# EAGLE schematic SolarRS485-V1.1 (EAGLE 7.4.0)
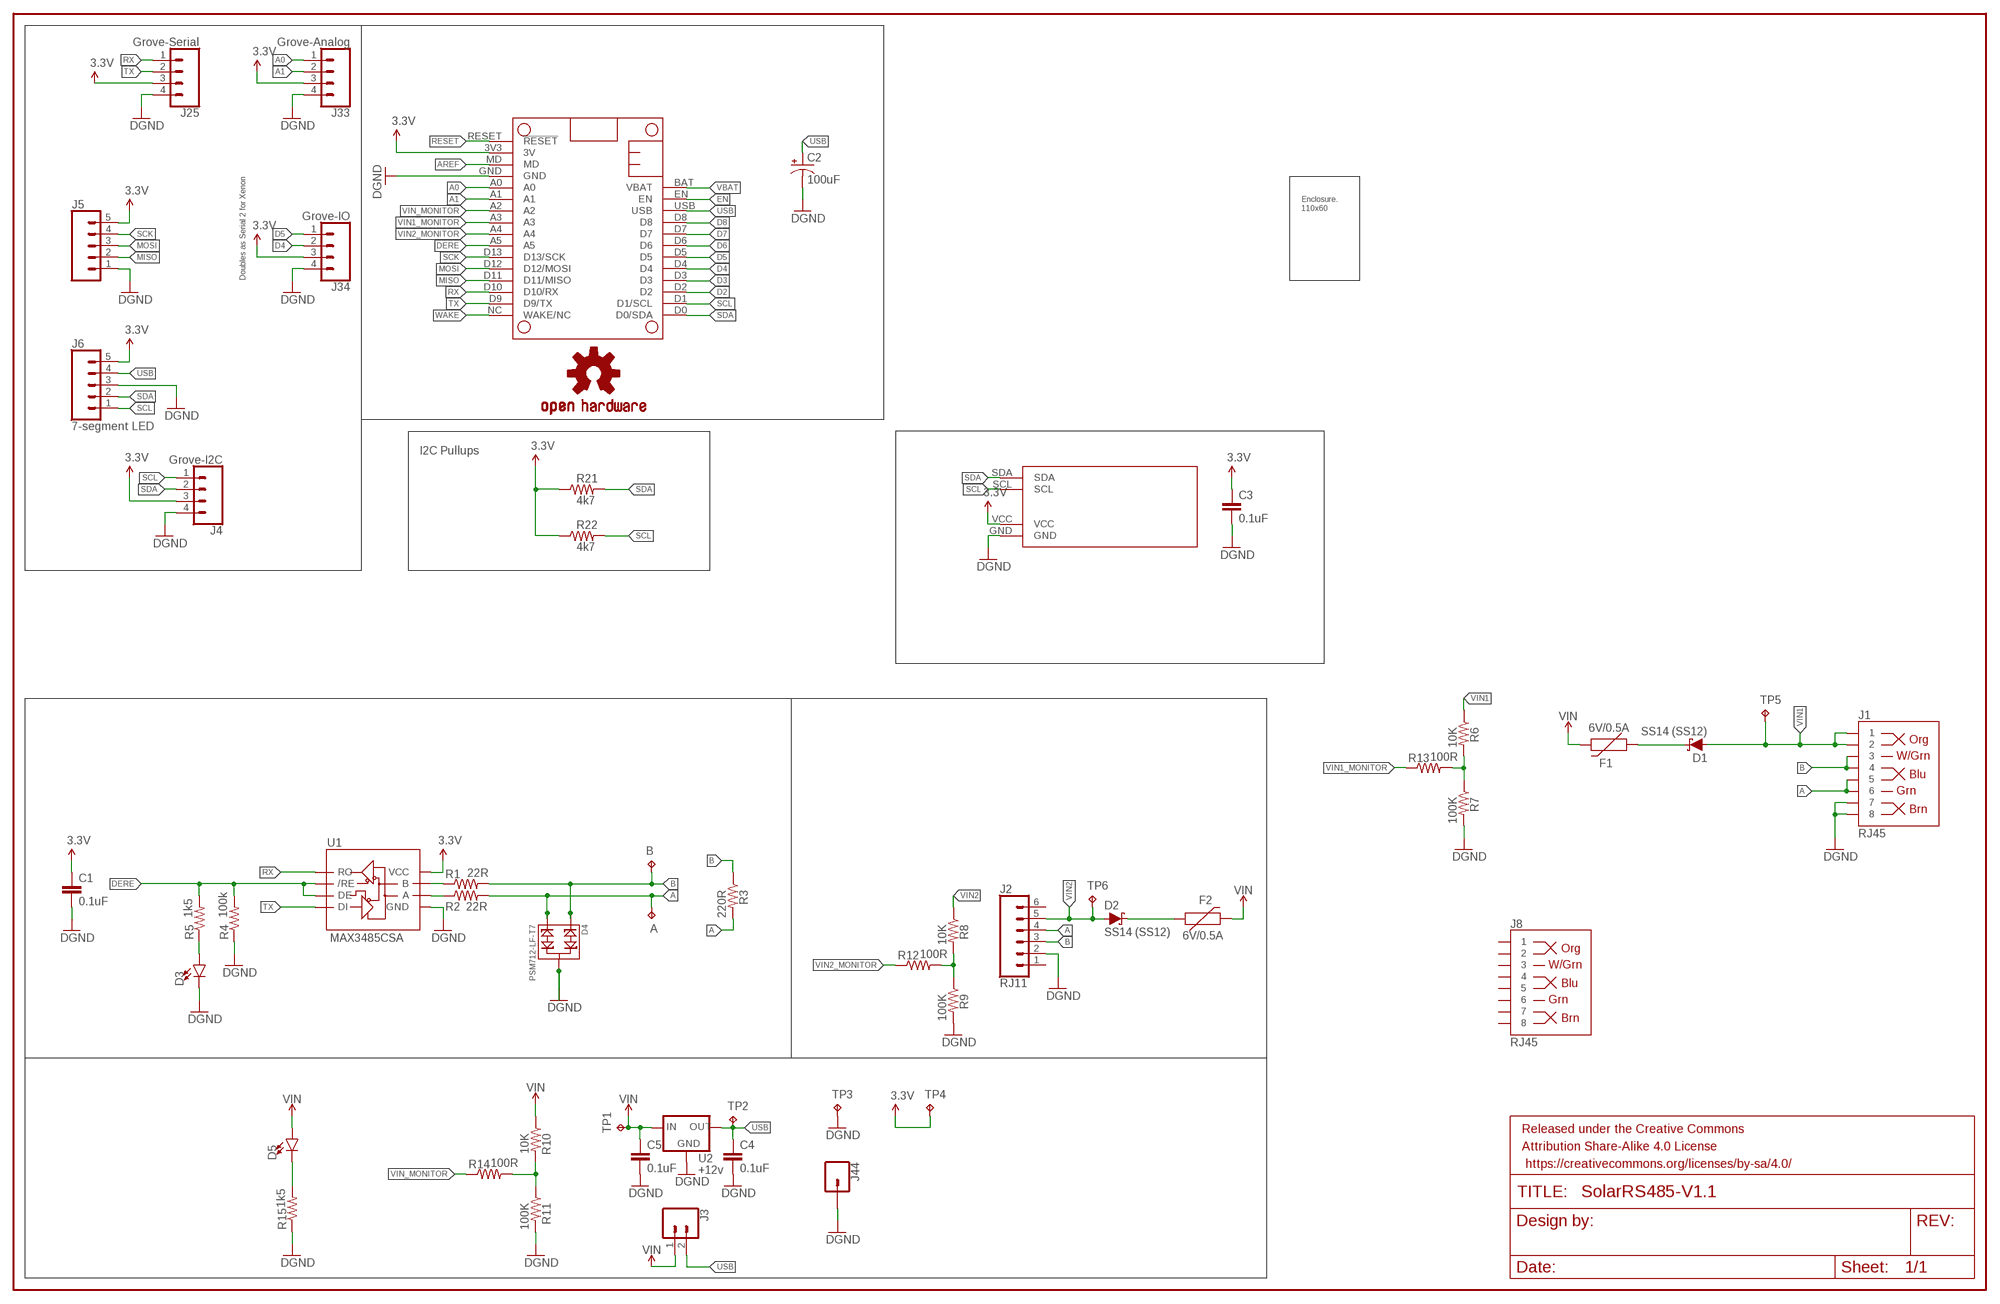
[diagram p0: schematic, sheet 1]

## Parts
A  TPTP15R  [TP15R]
B  TPTP15R  [TP15R]
C1  0.1uF  0.1UF-0805-25V  [0805]
C2  100uF  100UF-POLAR-RADIAL-2.5MM-25V-20%  [CPOL-RADIAL-2.5MM-6.5MM]
C3  0.1uF  0.1UF-0805-25V  [0805]
C4  0.1uF  0.1UF-0805-25V  [0805]
C5  0.1uF  0.1UF-0805-25V  [0805]
D1  SS14 (SS12)  DIODE-SCHOTTKY-SS14  [SMA-DIODE]
D2  SS14 (SS12)  DIODE-SCHOTTKY-SS14  [SMA-DIODE]
D3  LEDLED-1206-BOTTOM-2.0MM-BLUE  [LED-1206-BOTTOM-2.0MM]
D4  PSM712-LF-T7  SMD-DIODE-TVS-5V-225MW(SOT-23)  [SOT-23]
D5  LED1206  [LED-1206]
F1  6V/0.5A  PPTC_HALF-AMP  [1206]
F2  6V/0.5A  PPTC_HALF-AMP  [1206]
FRAME2  FRAME-LEDGER  [CREATIVE_COMMONS]
J1  RJ45  RJ45-8  [RJ45-8]
J2  RJ11  RJ11-6  [RJ11-6]
J3  CONN_02  [1X02]
J4  Grove-I2C  CONN_04GROVE-JST-PH-4-2MM  [JST-4-PH-GROVE]
J5  CONN_05  [1X05]
J6  7-segment LED  CONN_05  [1X05]
J8  RJ45  RJ45-8  [RJ45-8]
J25  Grove-Serial  CONN_04GROVE-JST-PH-4-2MM  [JST-4-PH-GROVE]
J33  Grove-Analog  CONN_04GROVE-JST-PH-4-2MM  [JST-4-PH-GROVE]
J34  Grove-IO  CONN_04GROVE-JST-PH-4-2MM  [JST-4-PH-GROVE]
J44  CONN_01PTH_NO_SILK_YES_STOP  [1X01_NO_SILK]
LOGO1  OSHW-LOGOM  [OSHW-LOGO-M]
MS1  XENONA  [XENON_BREAKOUT_A]
R1  22R  RESISTOR0805  [0805]
R2  22R  RESISTOR0805  [0805]
R3  220R  RESISTOR0805  [0805]
R4  100k  RESISTOR0805  [0805]
R5  1k5  RESISTOR0805  [0805]
R6  10K  RESISTOR0805  [0805]
R7  100K  RESISTOR0805  [0805]
R8  10K  RESISTOR0805  [0805]
R9  100K  RESISTOR0805  [0805]
R10  10K  RESISTOR0805  [0805]
R11  100K  RESISTOR0805  [0805]
R12  100R  RESISTOR0805  [0805]
R13  100R  RESISTOR0805  [0805]
R14  100R  RESISTOR0805  [0805]
R15  1k5  RESISTOR0805  [0805]
R21  4k7  RESISTOR0805  [0805]
R22  4k7  RESISTOR0805  [0805]
TP1  TPTP15R  [TP15R]
TP2  TPTP15R  [TP15R]
TP3  TPTP15R  [TP15R]
TP4  TPTP15R  [TP15R]
TP5  TPTP15R  [TP15R]
TP6  TPTP15R  [TP15R]
U1  MAX3485CSA  RS485SOIC  [SO08]
U2  +12v  V_REG_78XX7812  [TO-252]
U$1  CAMDENBOSS-ENCLOSURE-110X60BOTH-EXTENDED-WIDE  [CAMDENBOSS_ENCLOSURE_110X60_WIDE_EXTENDED]
U$2  DISPLAY0.96_INCH_DISPLAY  [I2C_DISPLAY_0.96_INCH]

## Nets
3.3V: C1.1 C3.1 J4.3 J5.5 J6.5 J25.3 J33.3 J34.3 MS1.3V3(3V) R21.1 R22.1 TP4.TP U1.8(VCC) U$2.VCC
A: A.TP D4.2 J1.5 J1.6 J2.4 R2.2 R3.2
A0: J33.1 MS1.A0
A1: J33.2 MS1.A1
AREF: MS1.MD
B: B.TP D4.1 J1.3 J1.4 J2.3 R1.2 R3.1
D2: MS1.D2
D3: MS1.D3
D4: J34.2 MS1.D4
D5: J34.1 MS1.D5
D6: MS1.D6
D7: MS1.D7
D8: MS1.D8
DERE: MS1.A5 R4.2 R5.2 U1.2(/RE) U1.3(DE)
EN: MS1.EN
GND: C1.2 C2.2(-) C3.2 C4.2 C5.2 D3.C D4.3 J1.7 J1.8 J2.2 J4.4 J5.1 J6.3 J25.4 J33.4 J34.4 J44.1 MS1.GND R4.1 R7.2 R9.2 R11.2 R15.1 TP3.TP U1.5(GND) U2.3(GND) U$2.GND ; supply symbol labelled DGND
MISO: J5.2 MS1.D11(D11/MISO)
MOSI: J5.3 MS1.D12(D12/MOSI)
N$1: R10.2 R11.1 R14.2
N$3: R6.2 R7.1 R13.2
N$4: R8.2 R9.1 R12.2
N$6: D5.C R15.2
N$7: D2.C F2.1
N$11: D1.C F1.1
N$12: R1.1 U1.7(B)
N$13: R2.1 U1.6(A)
N$21: D3.A R5.1
RESET: MS1.RESET(!RESET)
RX: J25.1 MS1.D10(D10/RX) U1.1(RO)
SCK: J5.4 MS1.D13(D13/SCK)
SCL: J4.1 J6.1 MS1.D1(D1/SCL) R22.2 U$2.SCL
SDA: J4.2 J6.2 MS1.D0(D0/SDA) R21.2 U$2.SDA
TX: J25.2 MS1.D9(D9/TX) U1.4(DI)
USB: C2.1(+) C4.1 J3.2 J6.4 MS1.USB TP2.TP U2.2(OUT)
VBAT: MS1.BAT(VBAT)
VIN: C5.1 D5.A F1.2 F2.2 J3.1 R10.1 TP1.TP U2.1(IN)
VIN1: D1.A J1.1 J1.2 R6.1 TP5.TP
VIN1_MONITOR: MS1.A3 R13.1
VIN2: D2.A J2.5 R8.1 TP6.TP
VIN2_MONITOR: MS1.A4 R12.1
VIN_MONITOR: MS1.A2 R14.1
WAKE: MS1.NC(WAKE/NC)
Unconnected: J2.1 J2.6 J8.1 J8.2 J8.3 J8.4 J8.5 J8.6 J8.7 J8.8

## Notes on the sheet
- Doubles as Serial 2 for Xenon
- I2C Pullups

## Library data of the parts
A B TP1-TP6 = testpad:TP: Test pad
C1 C4 C5 = ThingySticks:0.1UF: 0.1µF ceramic capacitors A capacitor is a passive two-terminal electrical component used to store electrical energy temporarily in an electric field.; LCSC: C49678
C2 = SparkFun-Capacitors:100UF-POLAR: 100µF polarized capacitors A capacitor is a passive two-terminal electrical component used to store electrical energy temporarily in an electric field.; PROD_ID: CAP-08439
C3 = ThingySticks:0.1UF: 0.1µF ceramic capacitors A capacitor is a passive two-terminal electrical component used to store electrical energy temporarily in an electric field.
D1 D2 = SparkFun-DiscreteSemi:DIODE-SCHOTTKY: Schottky diode A Schottky diode is a semiconductor diode which has a low forward voltage drop and a very fast switching action.; LCSC: C2480; PROD_ID: DIO-08053; VALUE: 1A/40V/500mV
D3 = ThingySticks:LED: LED (Generic) Standard schematic elements and footprints for 5mm, 3mm, 1206, and 0603 sized LEDs. Generic LEDs with no color specified.; COLOR: Blue; FARNELL: 2217907; FORWARD_VOLTAGE: 3.3; LCSC: DNP
D4 = OPL_Circuit_Protection:SMD-DIODE-TVS-5V-225MW(SOT-23): 304050003; LCSC: C32677; MPN: CESD5V0AP; VALUE: 5V-225MW
D5 = ThingySticks:LED: LED (Generic) Standard schematic elements and footprints for 5mm, 3mm, 1206, and 0603 sized LEDs. Generic LEDs with no color specified.
F1 = SparkFun-Fuses:PPTC: Resettable Fuse PPTC Resettable Fuse. Really a sort of resistor with a polymeric positive temperature coefficient whose resistance increases dramatically with an increase in temperature. When heated by the power passing through the resistance rises causing the current to be limited, protecting the circuit. This is achieved by the transition of the polymer from a crystalline to an amorphous state where the conductive carbon separates breaking the conductive pathways found in the cool crystalline structure. When a PPTC cools back down it resumes conducting letting the circuit turn back on. SparkFun Products: SparkFun RedBoard - Programmed with Arduino <https://www.sparkfun.com/products/12757> Pro Micro - 5V/16MHz <https://www.sparkfun.com/products/12640> Arduino Pro 328 - 5V/16MHz <https://www.sparkfun.com/products/10915> MP3 Trigger <https://www.sparkfun.com/products/13720>; LCSC: C135338; PROD_ID: RES-08585
F2 = SparkFun-Fuses:PPTC: Resettable Fuse PPTC Resettable Fuse. Really a sort of resistor with a polymeric positive temperature coefficient whose resistance increases dramatically with an increase in temperature. When heated by the power passing through the resistance rises causing the current to be limited, protecting the circuit. This is achieved by the transition of the polymer from a crystalline to an amorphous state where the conductive carbon separates breaking the conductive pathways found in the cool crystalline structure. When a PPTC cools back down it resumes conducting letting the circuit turn back on. SparkFun Products: SparkFun RedBoard - Programmed with Arduino <https://www.sparkfun.com/products/12757> Pro Micro - 5V/16MHz <https://www.sparkfun.com/products/12640> Arduino Pro 328 - 5V/16MHz <https://www.sparkfun.com/products/10915> MP3 Trigger <https://www.sparkfun.com/products/13720>; PROD_ID: RES-08585
FRAME2 = SparkFun-Aesthetics:FRAME-LEDGER: Schematic Frame Standard 11x14 US Ledger frame
J1 J8 = SparkFun-Connectors:RJ45-8: RJ45 Jack - 8 pin Simple RJ45, 8-pin connection. Commonly used for Cat5, Cat5e, and Cat6 Ethernet cables. Here is the connector we sell at SparkFun: RJ45 8-Pin Connector <https://www.sparkfun.com/products/643> (PRT-00643) Datasheet <https://cdn.sparkfun.com/datasheets/Prototyping/04908.pdf> It is used on this SparkFun product: SparkFun RJ45 Breakout <https://www.sparkfun.com/products/716> (BOB-00716) Note, you may also be interested in the "MAGJACK" version of this. It is basically a RJ45 connector, but also has some status LEDs built into the connector housing. You can check that out in this library at the device named "MAGJACK.dev" and see these products online: RJ45 Ethernet MagJack-Compatible <https://www.sparkfun.com/products/8534> (PRT-08534) SparkFun RJ45 MagJack Breakout <https://www.sparkfun.com/products/13021> (BOB-13021); PROD_ID: CONN-08506; SF_ID: PRT-00643
J2 = SparkFun-Connectors:RJ11-6: RJ11 Jack - 6 pin Commonly found on CAT3 devices and some Microchip programmers. Here is the connector we sell at SparkFun: RJ11 6-Pin Connector <https://www.sparkfun.com/products/132> (PRT-00132) Datasheet <http://www.sparkfun.com/datasheets/Prototyping/Connectors/RJ11-Datasheet.pdf> It is used on this SparkFun product: SparkFun Weather Shield <https://www.sparkfun.com/products/12081> (DEV-12081) Weather Meters <https://www.sparkfun.com/products/8942> (SEN-08942); PROD_ID: CONN-08590; SF_ID: PRT-00132
J3 = ThingySticks:CONN_02: Multi connection point. Often used as Generic Header-pin footprint for 0.1 inch spaced/style header connections On any of the 0.1 inch spaced packages, you can populate with these: Break Away Headers - Straight <https://www.sparkfun.com/products/116> (PRT-00116) Break Away Male Headers - Right Angle <https://www.sparkfun.com/products/553> (PRT-00553) Female Headers <https://www.sparkfun.com/products/115> (PRT-00115) Break Away Headers - Machine Pin <https://www.sparkfun.com/products/117> (PRT-00117) Break Away Female Headers - Swiss Machine Pin <https://www.sparkfun.com/products/743> (PRT-00743) For SCREWTERMINALS and SPRING TERMINALS visit here: Screw Terimnals on SparkFun.com <https://www.sparkfun.com/search/results?term=Screw+Terminals> (5mm/3.5mm/2.54mm spacing) This device is also useful as a general connection point to wire up your design to another part of your project. Our various solder wires solder well into these plated through hole pads. Hook-Up Wire - Assortment (Stranded, 22 AWG) <https://www.sparkfun.com/products/11375> (PRT-11375) Hook-Up Wire - Assortment (Solid Core, 22 AWG) <https://www.sparkfun.com/products/11367> (PRT-11367) View the entire wire category on our website here <https://www.sparkfun.com/categories/141> Special notes: Molex polarized connector foot print use with: PRT-08233 with associated crimp pins and housings. 2.54_SCREWTERM for use with PRT-10571. 3.5mm Screw Terminal footprints for PRT-08084 5mm Screw Terminal footprints for use with PRT-08432
J4 J25 J33 J34 = ThingySticks:CONN_04: Multi connection point. Often used as Generic Header-pin footprint for 0.1 inch spaced/style header connections On any of the 0.1 inch spaced packages, you can populate with these: Break Away Headers - Straight <https://www.sparkfun.com/products/116> (PRT-00116) Break Away Male Headers - Right Angle <https://www.sparkfun.com/products/553> (PRT-00553) Female Headers <https://www.sparkfun.com/products/115> (PRT-00115) Break Away Headers - Machine Pin <https://www.sparkfun.com/products/117> (PRT-00117) Break Away Female Headers - Swiss Machine Pin <https://www.sparkfun.com/products/743> (PRT-00743) For SCREWTERMINALS and SPRING TERMINALS visit here: Screw Terimnals on SparkFun.com <https://www.sparkfun.com/search/results?term=Screw+Terminals> (5mm/3.5mm/2.54mm spacing) This device is also useful as a general connection point to wire up your design to another part of your project. Our various solder wires solder well into these plated through hole pads. Hook-Up Wire - Assortment (Stranded, 22 AWG) <https://www.sparkfun.com/products/11375> (PRT-11375) Hook-Up Wire - Assortment (Solid Core, 22 AWG) <https://www.sparkfun.com/products/11367> (PRT-11367) View the entire wire category on our website here <https://www.sparkfun.com/categories/141> Special notes: Molex polarized connector foot print use with SKU : PRT-08231 with associated crimp pins and housings. 1MM SMD Version SKU: PRT-10208
J5 J6 = SparkFun-Connectors:CONN_05: Multi connection point. Often used as Generic Header-pin footprint for 0.1 inch spaced/style header connections On any of the 0.1 inch spaced packages, you can populate with these: Break Away Headers - Straight <https://www.sparkfun.com/products/116> (PRT-00116) Break Away Male Headers - Right Angle <https://www.sparkfun.com/products/553> (PRT-00553) Female Headers <https://www.sparkfun.com/products/115> (PRT-00115) Break Away Headers - Machine Pin <https://www.sparkfun.com/products/117> (PRT-00117) Break Away Female Headers - Swiss Machine Pin <https://www.sparkfun.com/products/743> (PRT-00743) For SCREWTERMINALS and SPRING TERMINALS visit here: Screw Terimnals on SparkFun.com <https://www.sparkfun.com/search/results?term=Screw+Terminals> (5mm/3.5mm/2.54mm spacing) This device is also useful as a general connection point to wire up your design to another part of your project. Our various solder wires solder well into these plated through hole pads. Hook-Up Wire - Assortment (Stranded, 22 AWG) <https://www.sparkfun.com/products/11375> (PRT-11375) Hook-Up Wire - Assortment (Solid Core, 22 AWG) <https://www.sparkfun.com/products/11367> (PRT-11367) View the entire wire category on our website here <https://www.sparkfun.com/categories/141> Special notes: Molex polarized connector foot print use with SKU : PRT-08231 with associated crimp pins and housings. 1MM SMD Version SKU: PRT-10208
J44 = SparkFun-Connectors:CONN_01: Single connection point. Often used as Generic Header-pin footprint for 0.1 inch spaced/style header connections On any of the 0.1 inch spaced packages, you can populate with these: Break Away Headers - Straight <https://www.sparkfun.com/products/116> (PRT-00116) Break Away Male Headers - Right Angle <https://www.sparkfun.com/products/553> (PRT-00553) Female Headers <https://www.sparkfun.com/products/115> (PRT-00115) Break Away Headers - Machine Pin <https://www.sparkfun.com/products/117> (PRT-00117) Break Away Female Headers - Swiss Machine Pin <https://www.sparkfun.com/products/743> (PRT-00743) This device is also useful as a general connection point to wire up your design to another part of your project. Our various solder wires solder well into these plated through hole pads. Hook-Up Wire - Assortment (Stranded, 22 AWG) <https://www.sparkfun.com/products/11375> (PRT-11375) Hook-Up Wire - Assortment (Solid Core, 22 AWG) <https://www.sparkfun.com/products/11367> (PRT-11367) View the entire wire category on our website here <https://www.sparkfun.com/categories/141> Special notes: SMTSO-256-ET is a "flush mount" nut for a 4-40 screw. We mostly use this on specialty testbeds; it is a nice way to connect hardware to your PCB at an adjustable hieght. Also note, the SNAP packages are for using a snappable style connector. We sell a baggie of snaps and they are also used on two LilyPad designs: Snap Assortment - 30 pack (male and female) <https://www.sparkfun.com/products/11347> (DEV-11347) LilyPad Arduino SimpleSnap <https://www.sparkfun.com/products/10941> (DEV-10941) LilyPad SimpleSnap Protoboard <https://www.sparkfun.com/products/10940> (DEV-10940)
LOGO1 = SparkFun-Aesthetics:OSHW-LOGO: Open Source Hardware Logo This logo indicates the piece of hardware it is found on incorporates a OSHW license and/or adheres to the definition of open source hardware found here: http://freedomdefined.org/OSHW
MS1 = ThingySticks:XENON
R1 R2 = SparkFun-Resistors:RESISTOR: Generic Resistor Package; LCSC: C17561
R3 = SparkFun-Resistors:RESISTOR: Generic Resistor Package; LCSC: C17557
R4 = SparkFun-Resistors:RESISTOR: Generic Resistor Package; LCSC: C17407
R5 R15 = SparkFun-Resistors:RESISTOR: Generic Resistor Package; LCSC: C4310
R6-R14 R21 R22 = SparkFun-Resistors:RESISTOR: Generic Resistor Package
U1 = SparkFun-IC-Comms:RS485: RS-485 Transceiver SP3485 Series 8 Pin NSOIC 3.3 V Low Power Half Duplex RS-485 Transceiver MAX3485 compatible Datasheet <http://www.sparkfun.com/datasheets/Components/General/sp3485CN-LTR.pdf> SparkFun Products SparkFun Transceiver Breakout - RS-485 <https://www.sparkfun.com/products/10124> (BOB-10124) SparkFun USB to RS-485 Converter <https://www.sparkfun.com/products/9822> (BOB-09822); FARNELL: 2518818; LCSC-1: C18148; LCSC-2: C9943; PROD_ID: IC-09388
U2 = SparkFun-IC-Power:V_REG_78XX: Voltage Regulator Standard 78xx regulator. IGO (Input Ground Output). Spark Fun Electronics SKU : COM-00107; PROD_ID: VREG-12370
U$1 = ThingySticks:CAMDENBOSS-ENCLOSURE-110X60
U$2 = ThingySticks:DISPLAY